# Altium schematic sheet COUNTER_WRP.SchDoc
size A; DocumentNumber: 6; SheetNumber: 6; SheetTotal: 13
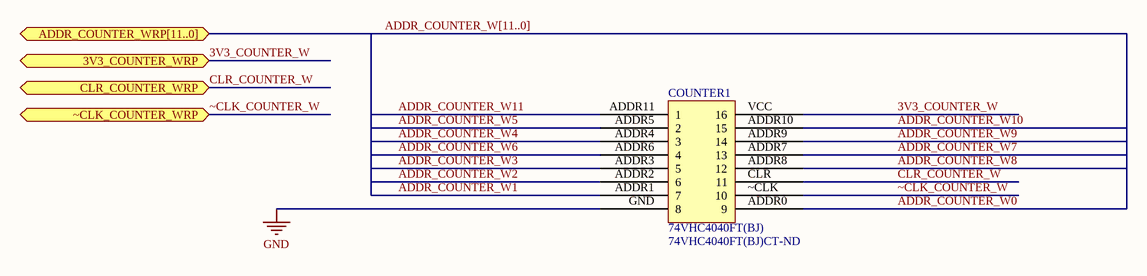
[diagram p0: COUNTER_WRP.SchDoc]

## Parts
COUNTER1  74VHC4040FT(BJ)  Supplier Part Number 1: 74VHC4040FT(BJ)CT-ND  [COUNTER_TSSOP16]

## Ports
3V3_COUNTER_WRP, ADDR_COUNTER_WRP[11..0], CLR_COUNTER_WRP, ~CLK_COUNTER_WRP

## Nets
GND: COUNTER1.GND(8)
3V3_COUNTER_W: COUNTER1.VCC(16) ; port 3V3_COUNTER_WRP
ADDR_COUNTER_W0: COUNTER1.ADDR0(9)
ADDR_COUNTER_W1: COUNTER1.ADDR1(7)
ADDR_COUNTER_W2: COUNTER1.ADDR2(6)
ADDR_COUNTER_W3: COUNTER1.ADDR3(5)
ADDR_COUNTER_W4: COUNTER1.ADDR4(3)
ADDR_COUNTER_W5: COUNTER1.ADDR5(2)
ADDR_COUNTER_W6: COUNTER1.ADDR6(4)
ADDR_COUNTER_W7: COUNTER1.ADDR7(13)
ADDR_COUNTER_W8: COUNTER1.ADDR8(12)
ADDR_COUNTER_W9: COUNTER1.ADDR9(14)
ADDR_COUNTER_W10: COUNTER1.ADDR10(15)
ADDR_COUNTER_W11: COUNTER1.ADDR11(1)
CLR_COUNTER_W: COUNTER1.CLR(11) ; port CLR_COUNTER_WRP
~CLK_COUNTER_W: COUNTER1.~CLK(10) ; port ~CLK_COUNTER_WRP

## Buses and harness runs
bus ADDR_COUNTER_W[11..0] = port ADDR_COUNTER_WRP[11..0]

## Library data of the parts
COUNTER1 = 74VHC4040FT(BJ): IC COUNTER BIN 12STAGE 16-TSSOP; Manufacturer: Toshiba Semiconductor and Storage; Logic Type: Binary Counter; Direction: Up; Number of Elements: 1; Number of Bits per Element: 12; Reset: Asynchronous; Count Rate: 210MHz; Trigger Type: Negative Edge; Voltage - Supply: 2 V ~ 5.5 V; Supplier 1: Digi-Key; Manufacturer Part Number: 74VHC4040FT(BJ); RoHS: RoHS Compliant; Category: Integrated Circuits (ICs); Stock 1: 4371; Pricing 1: 1=0.54, 10=0.42, 25=0.3544, 100=0.2888, 250=0.2392, 500=0.1976, 1000=0.148 (USD); Packaging: Cut Tape (CT); Timing: -; Operating Temperature: -40°C ~ 85°C; Mounting Type: Surface Mount; Package / Case: 16-TSSOP (0.173", 4.40mm Width); Supplier Device Package: 16-TSSOPB; ComponentLink1URL: http://www.semicon.toshiba.co.jp/info/docget.jsp?type=datasheet&lang=en&pid=74VHC4040FT; ComponentLink1Description: http://www.semicon.toshiba.co.jp/info/docget.jsp?type=datasheet&lang=en&pid=74VHC4040FT